# EAGLE schematic more testing (EAGLE 9.1.3)
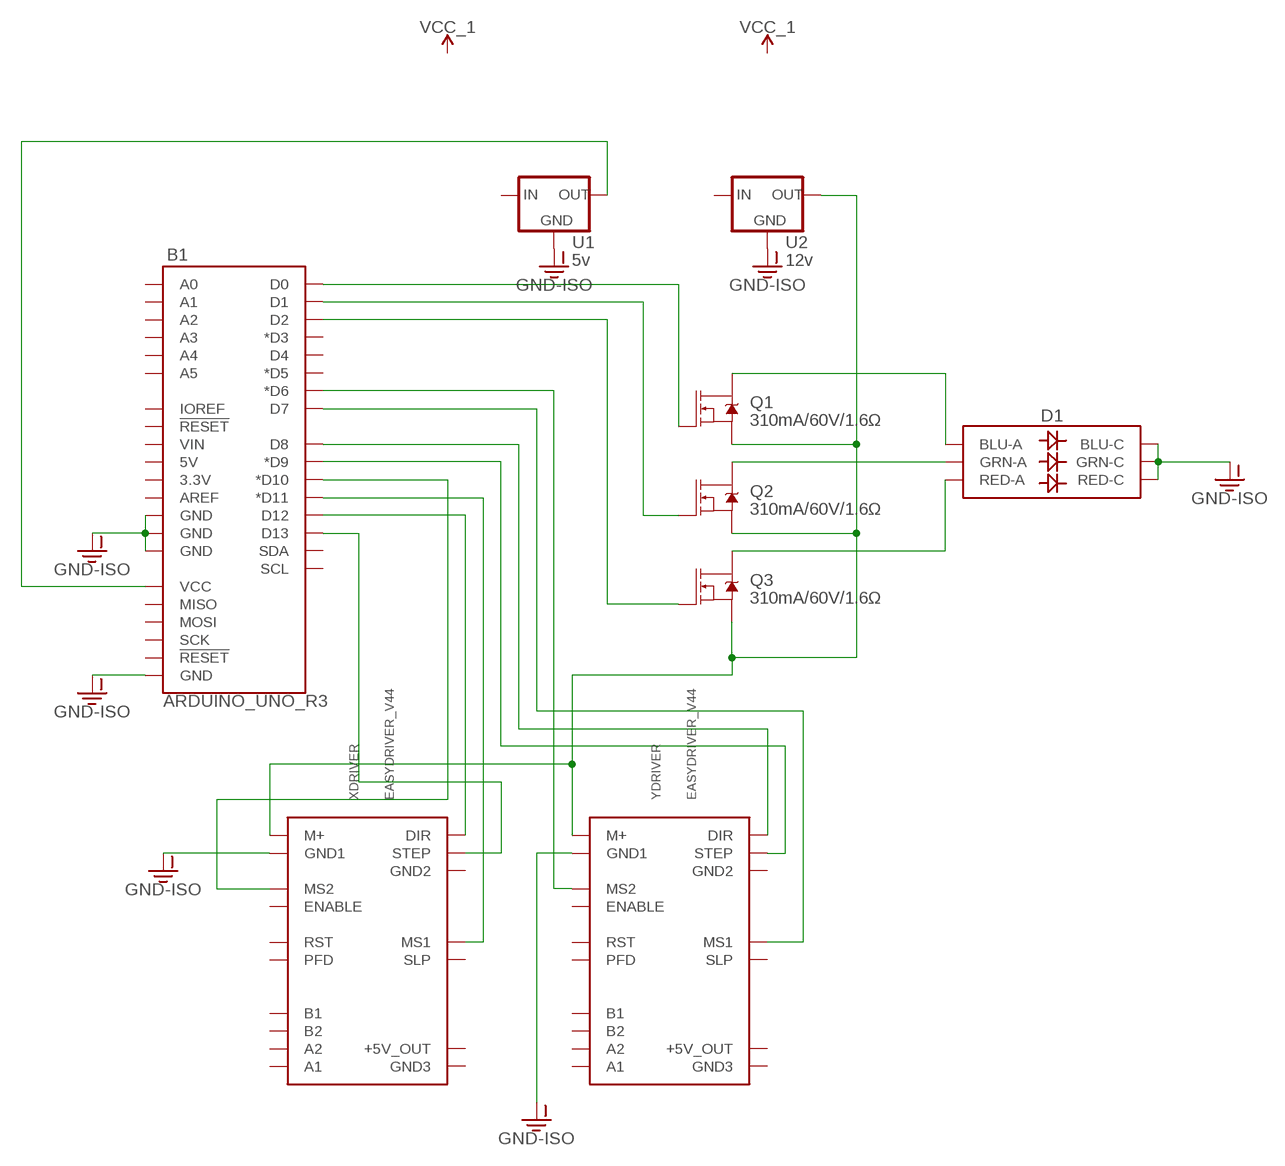
[diagram p0: schematic, sheet 1]

## Parts
B1  ARDUINO_UNO_R3  [ARDUINO_R3]
D1  LED-RGBNO_IC  [LED-TRICOLOR-5050]
Q1  310mA/60V/1.6Ω  MOSFET-NCH-2N7002PW  [SOT323]
Q2  310mA/60V/1.6Ω  MOSFET-NCH-2N7002PW  [SOT323]
Q3  310mA/60V/1.6Ω  MOSFET-NCH-2N7002PW  [SOT323]
U1  5v  V_REG_78XXSIDE  [78XXL]
U2  12v  V_REG_78XXSIDE  [78XXL]
XDRIVER  EASYDRIVER_V44  [EASYDRIVER_V44]
YDRIVER  EASYDRIVER_V44  [EASYDRIVER_V44]

## Nets
GND-ISO: B1.GND@1(GND) B1.GND@2(GND) B1.GND@3(GND) B1.GND@4(GND) D1.4(BLU-C) D1.5(RED-C) D1.6(GRN-C) U1.GND U2.GND XDRIVER.GND1 YDRIVER.GND1
N$1: B1.VCC U1.OUT
N$2: B1.D13 XDRIVER.STEP
N$3: B1.D12 XDRIVER.DIR
N$4: B1.D0 Q1.1(G)
N$5: B1.D1 Q2.1(G)
N$6: B1.D2 Q3.1(G)
N$7: D1.3(BLU-A) Q1.3(D)
N$8: D1.1(GRN-A) Q2.3(D)
N$9: D1.2(RED-A) Q3.3(D)
N$10: Q1.2(S) Q2.2(S) Q3.2(S) U2.OUT XDRIVER.M+ YDRIVER.M+
N$13: B1.D11(*D11) XDRIVER.MS1
N$14: B1.D10(*D10) XDRIVER.MS2
N$15: B1.D9(*D9) YDRIVER.STEP
N$16: B1.D8 YDRIVER.DIR
N$17: B1.D7 YDRIVER.MS1
N$18: B1.D6(*D6) YDRIVER.MS2
Unconnected: B1.3.3V B1.5V B1.A0 B1.A1 B1.A2 B1.A3 B1.A4 B1.A5 B1.AREF B1.D3(*D3) B1.D4 B1.D5(*D5) B1.IOREF B1.MISO B1.MOSI B1.RESET@1(!RESET!) B1.RESET@2(!RESET!) B1.SCK B1.SCL B1.SDA B1.VIN U1.IN U2.IN XDRIVER.A1 XDRIVER.A2 XDRIVER.B1 XDRIVER.B2 XDRIVER.ENABLE XDRIVER.GND2 XDRIVER.GND3 XDRIVER.P$11(+5V_OUT) XDRIVER.PFD XDRIVER.RST XDRIVER.SLEEP(SLP) YDRIVER.A1 YDRIVER.A2 YDRIVER.B1 YDRIVER.B2 YDRIVER.ENABLE YDRIVER.GND2 YDRIVER.GND3 YDRIVER.P$11(+5V_OUT) YDRIVER.PFD YDRIVER.RST YDRIVER.SLEEP(SLP)

## Library data of the parts
B1 = SparkFun-Boards:ARDUINO_UNO_R3: Arduino R3 Footprint with SPI header Arduino Uno R3 Compatible Footprint. Matches PCB size of the original board. SparkFun Products: SAMD21 Dev Breakout <https://www.sparkfun.com/products/13672> RedBoard <https://www.sparkfun.com/products/12757> R3 Stackable Headers <https://www.sparkfun.com/products/11417>
D1 = SparkFun-LED:LED-RGB: LED-RGB 6 pin RGB LED (no common connector) Packages: PLCC-6 LED-TRICOLOR-5050 - No built-in IC SparkFun Products: Digital Sandbox <https://www.sparkfun.com/products/12651> LED- SMD RGB <https://www.sparkfun.com/products/10866>; PROD_ID: DIO-10298
Q1-Q3 = SparkFun-DiscreteSemi:MOSFET-NCH: N-channel MOSFETs Voltage controlled devices that allow control of high current outputs. SparkFun Products: SparkFun OpenScale <https://www.sparkfun.com/products/13261> SparkFun Digital Sandbox <https://www.sparkfun.com/products/12651> SparkFun Monster Moto Shield <https://www.sparkfun.com/products/10182> SparkFun MOSFET Power Controller <https://www.sparkfun.com/products/11214>; PROD_ID: TRANS-11151
U1 U2 = SparkFun-IC-Power:V_REG_78XX: Voltage Regulator Standard 78xx regulator. IGO (Input Ground Output). Spark Fun Electronics SKU : COM-00107
XDRIVER YDRIVER = EasyDriver:EASYDRIVER_V44: EasyDriver version 4.4 - http://www.schmalzhaus.com/EasyDriver